# Altium schematic sheet +20_to_+12.SchDoc
size A; SheetNumber: 4; SheetTotal: 6
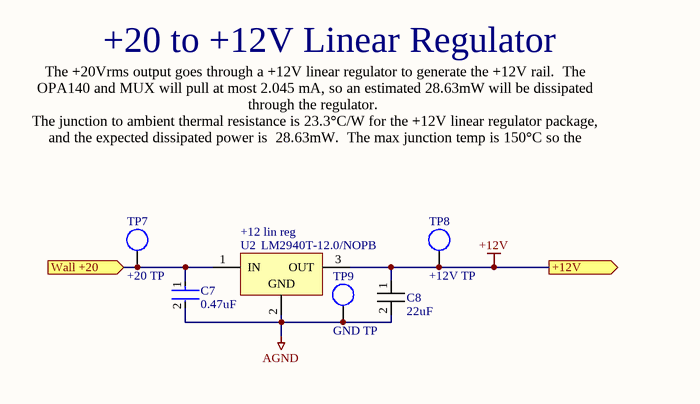
[diagram p0: +20_to_+12.SchDoc]

## Parts
C7  0.47uF  [FP-C0805C-DG-MFG]
C8  22uF  [CAPPRD200W50D550H1250]
TP7  +20 TP  [PCBComponent_1]
TP8  +12V TP  [PCBComponent_1]
TP9  GND TP  [PCBComponent_1]
U2  LM2940T-12.0/NOPB  [NDE0003A]

## Ports
+12V (out), Wall +20 (in)

## Nets
+12V: C8.1(+) TP8.TP U2.3(OUT) ; port +12V
AGND: C7.2 C8.2(-) TP9.TP U2.2(GND)
Wall +20: C7.1 TP7.TP U2.1(IN) ; port Wall +20

## Notes on the sheet
- +20 to +12V Linear Regulator
- The +20Vrms output goes through a +12V linear regulator to generate the +12V rail.  The OPA140 and MUX will pull at most 2.045 mA, so an estimated 28.63mW will be dissipated through the regulator.
  The junction to ambient thermal resistance is 23.3°C/W for the +12V linear regulator package, and the expected dissipated power is  28.63mW.  The max junction temp is 150°C so the dissipation will cause 0.667°C, acceptable for the IC.
- (near U2) +12 lin reg

## Library data of the parts
C7 = CMP-2007-03243-2: CAP CER 10UF 10V X5R 0805; Manufacturer Part Number: C0805C106K8PACTU; Manufacturer: Kemet; 3DS Part Number: 220-00001; Tolerance: 10%; Temperature Coefficient: 15%; Material: Ceramic; Device Class L2: Capacitors; Device Class L1: Passive Components; ComponentLink2URL: https://content.kemet.com/datasheets/KEM_C1006_X5R_SMD.pdf; Height: 1.4mm; Lead Free: Yes; Digikey Description: CAP CER 10UF 10V X5R 0805; Octopart: https://octopart.com/c0805c106k8pactu-kemet-98697; Capacitance: 10uF; Value: 10uF; Temperature Range Low: -55°C; Temperature: -55°C to +85°C; Automotive: No; Mouser Description: CAP CER 10UF 10V X5R 0805; Ipc Land Pattern Name: CAPC200125X125; Temperature Range High: +85°C; Voltage: 10V; RoHS: TRUE; Device Class L3: Ceramic Capacitors; ComponentLink2Description: Datasheet; Voltage Rating: 10V; Package: C0805C-DG; Temperature Characteristic: X5R; Category: Cap
C8 = 860010572003-3: Wurth Elektronik 22 µF 35 V Aluminum Electrolytic Capacitors Radial, Can - 2000 Hrs @ 85°C; Pin 1 is +, Pin 2 is -
TP7-TP9 = Component_1
U2 = CMP-0062-02521-3: 1A Low Dropout Regulator, 3-pin TO-220, Pb-Free; Manufacturer: Texas Instruments; PowerWise: N; CompType: LDO IC; PackageTopMarking: NSUZXYTTE#*LM2940T*12.0 P+; PackageDescription: TO-220, Molded, 3 Lead, Straight; PinCount: 3; RoHS: Y; PackageReference: NDE0003A; ComponentLink1URL: http://www.ti.com/general/docs/lit/getliterature.tsp?genericPartNumber=LM2940-N&fileType=pdf; ComponentLink1Description: Datasheet URL